# EasyEDA Pro project ProProject_ECE590_2024-03-22.epro

# Schematic Schematic1
Create Date: 2024-03-17; Page Name: P1; Project Name: ECE590; Schematic Name: Schematic1; Update Date: 2024-03-20; Company: 嘉立创EDA; Page Size: A4; Version: V1.0
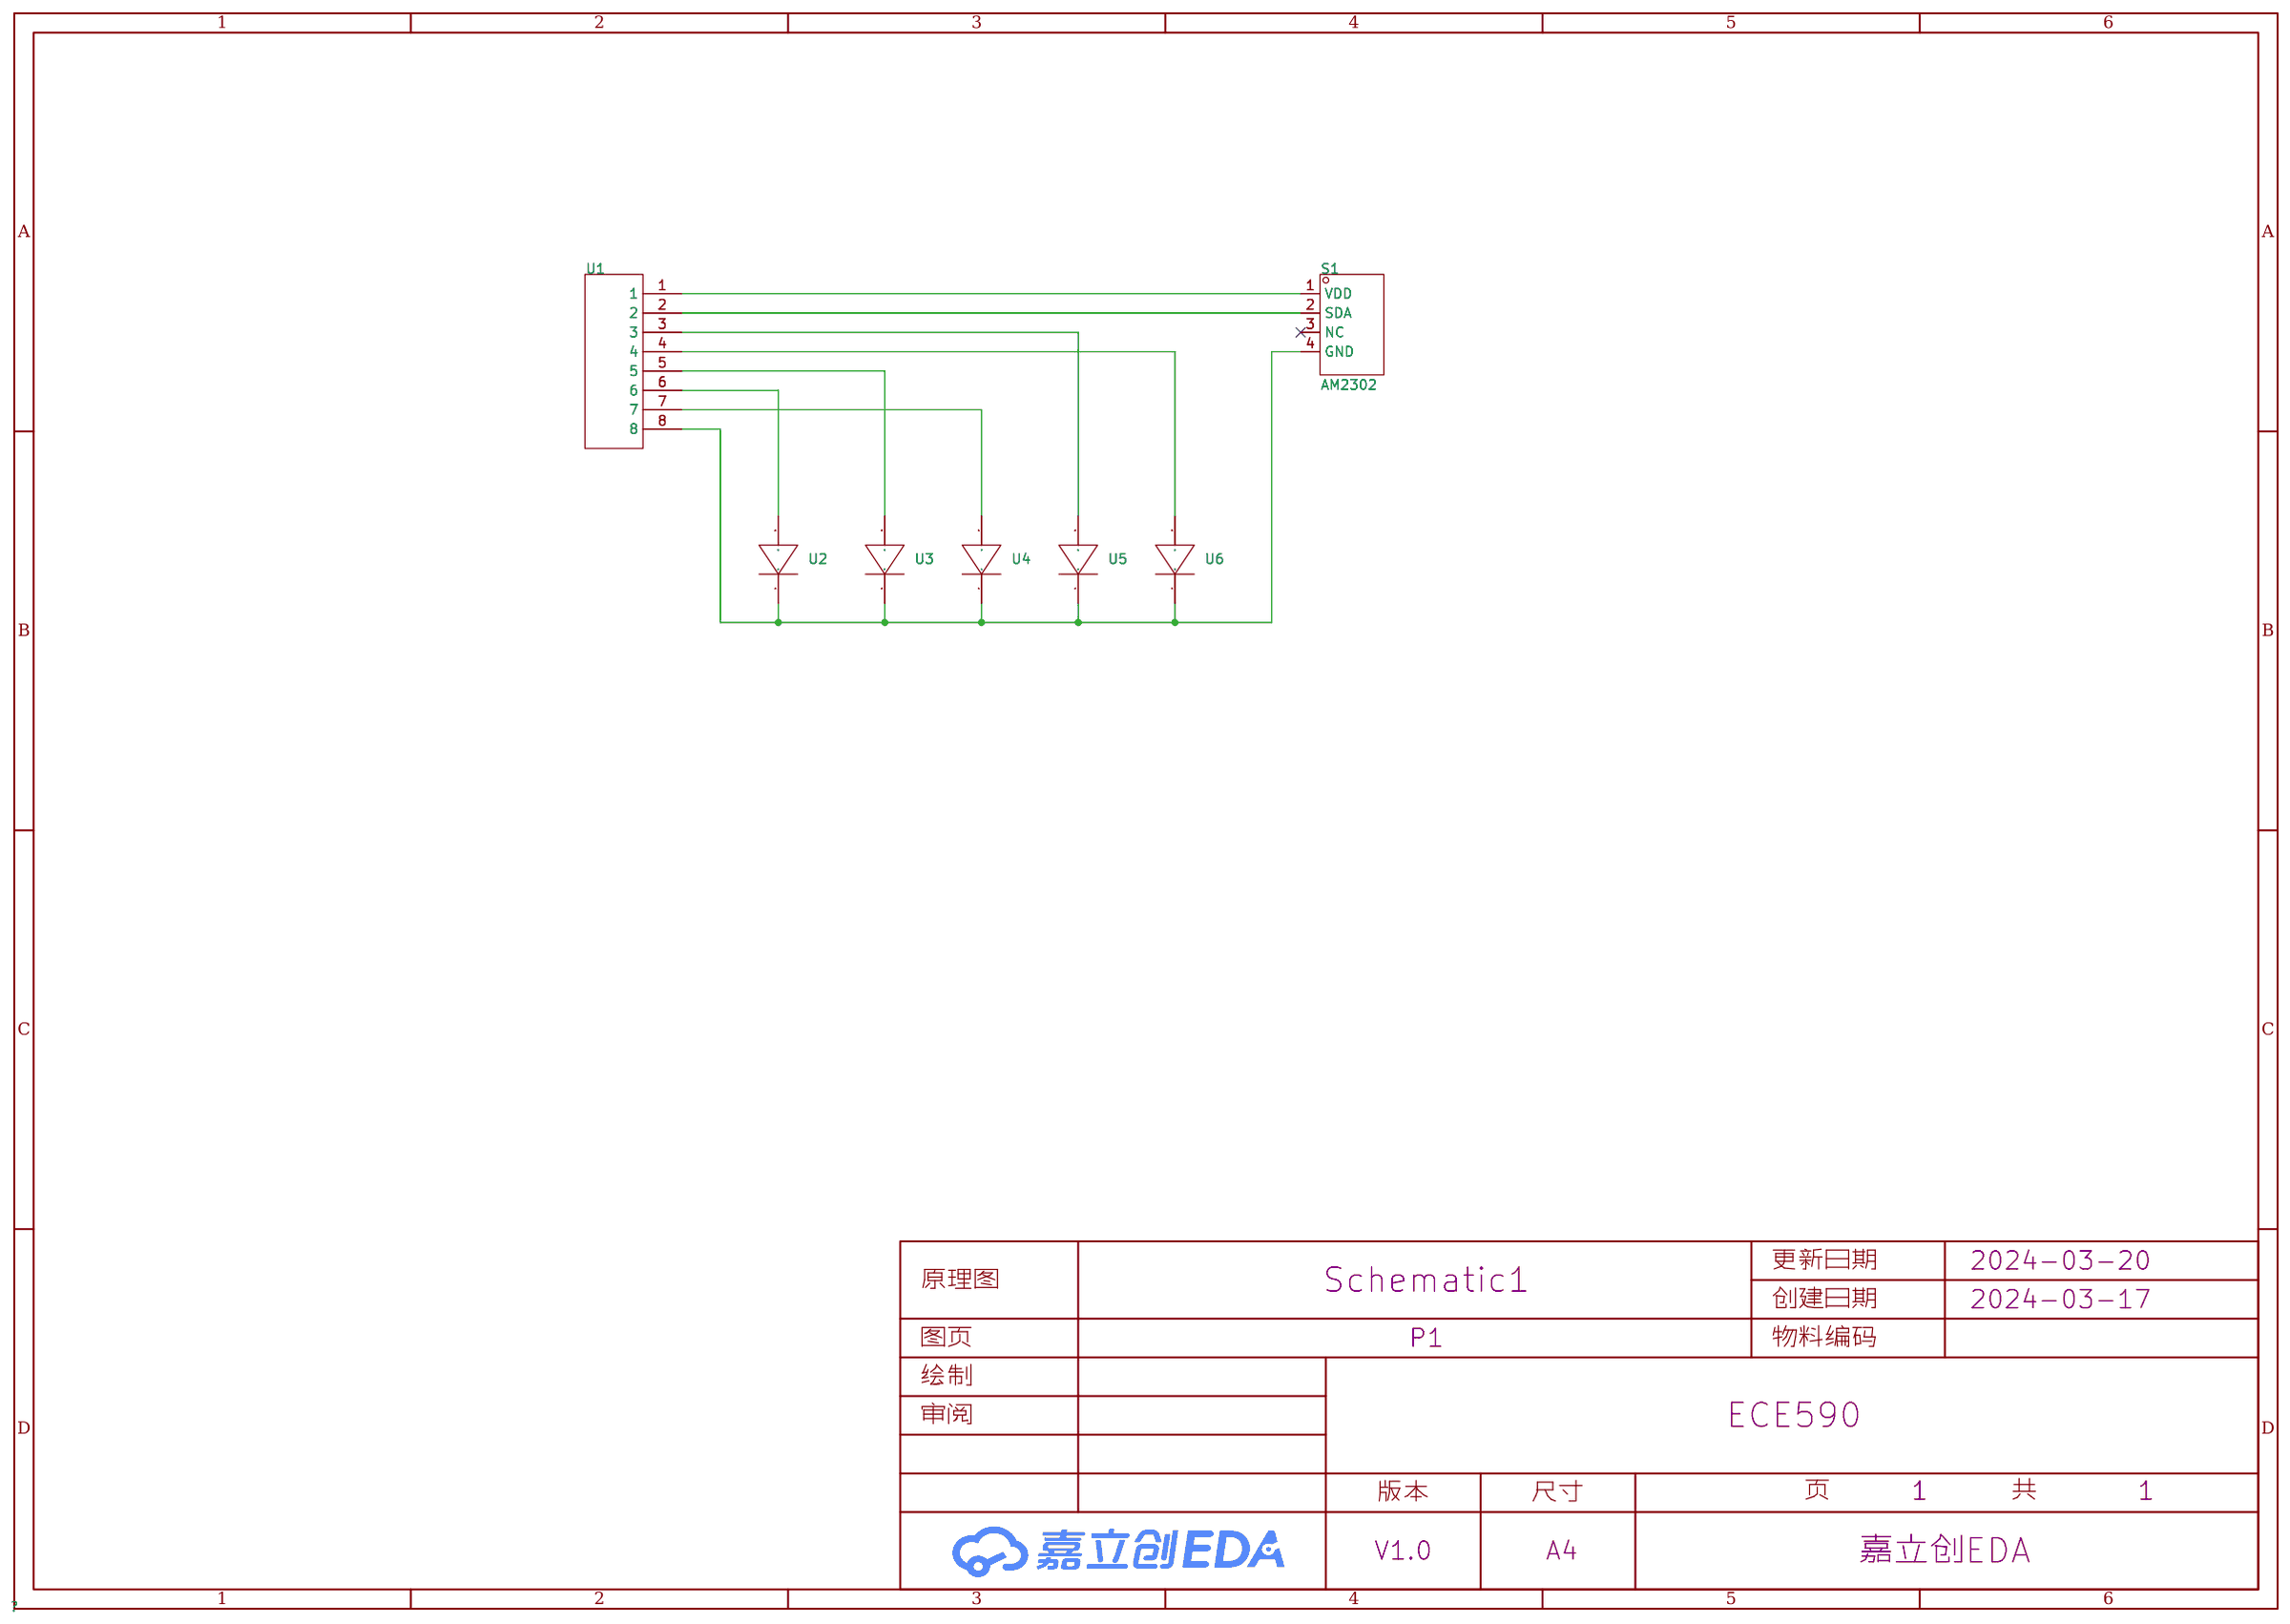
[diagram p0: schematic sheet]

## Parts
S1  AM2302  [SENSOR-TH_AM2302]
U1  -  [PIN-8]
U2  -  [LED_4x9]
U3  -  [LED_4x9]
U4  -  [LED_4x9]
U5  -  [LED_4x9]
U6  -  [LED_4x9]

## Library data of the parts
S1 = AM2302: 数字温湿度传感器25.3x15.4mmx7.8mm; LCSC Part Name: AM2302温湿度传感器; Supplier Part: C83988; Manufacturer: 广州奥松; Supplier Footprint: SIP-4; JLCPCB Part Class: 扩展库; Datasheet: https://atta.szlcsc.com/upload/public/pdf/source/20161123/1479873083101.pdf; Supplier: LCSC
U1 = PIN-8
U2-U6 = Adafruit_LED_4x9

## Nets
$1N1514: S1.1(VDD) U1.1
$1N1517: S1.2(SDA) U1.2
$1N1520: U1.3 U5.2
$1N1527: U1.4 U6.2
$1N1535: U1.5 U3.2
$1N1558: U1.6 U2.2
$1N1565: U1.7 U4.2
$1N1569: S1.4(GND) U1.8 U2.1 U3.1 U4.1 U5.1 U6.1

Not connected (* = marked no-connect by the designer): S1 3(NC)*

# Schematic Schematic2
Create Date: 2024-03-22; Page Name: P1; Project Name: ECE590; Schematic Name: Schematic2; Update Date: 2024-03-21; Company: 嘉立创EDA; Page Size: A4; Version: V1.0
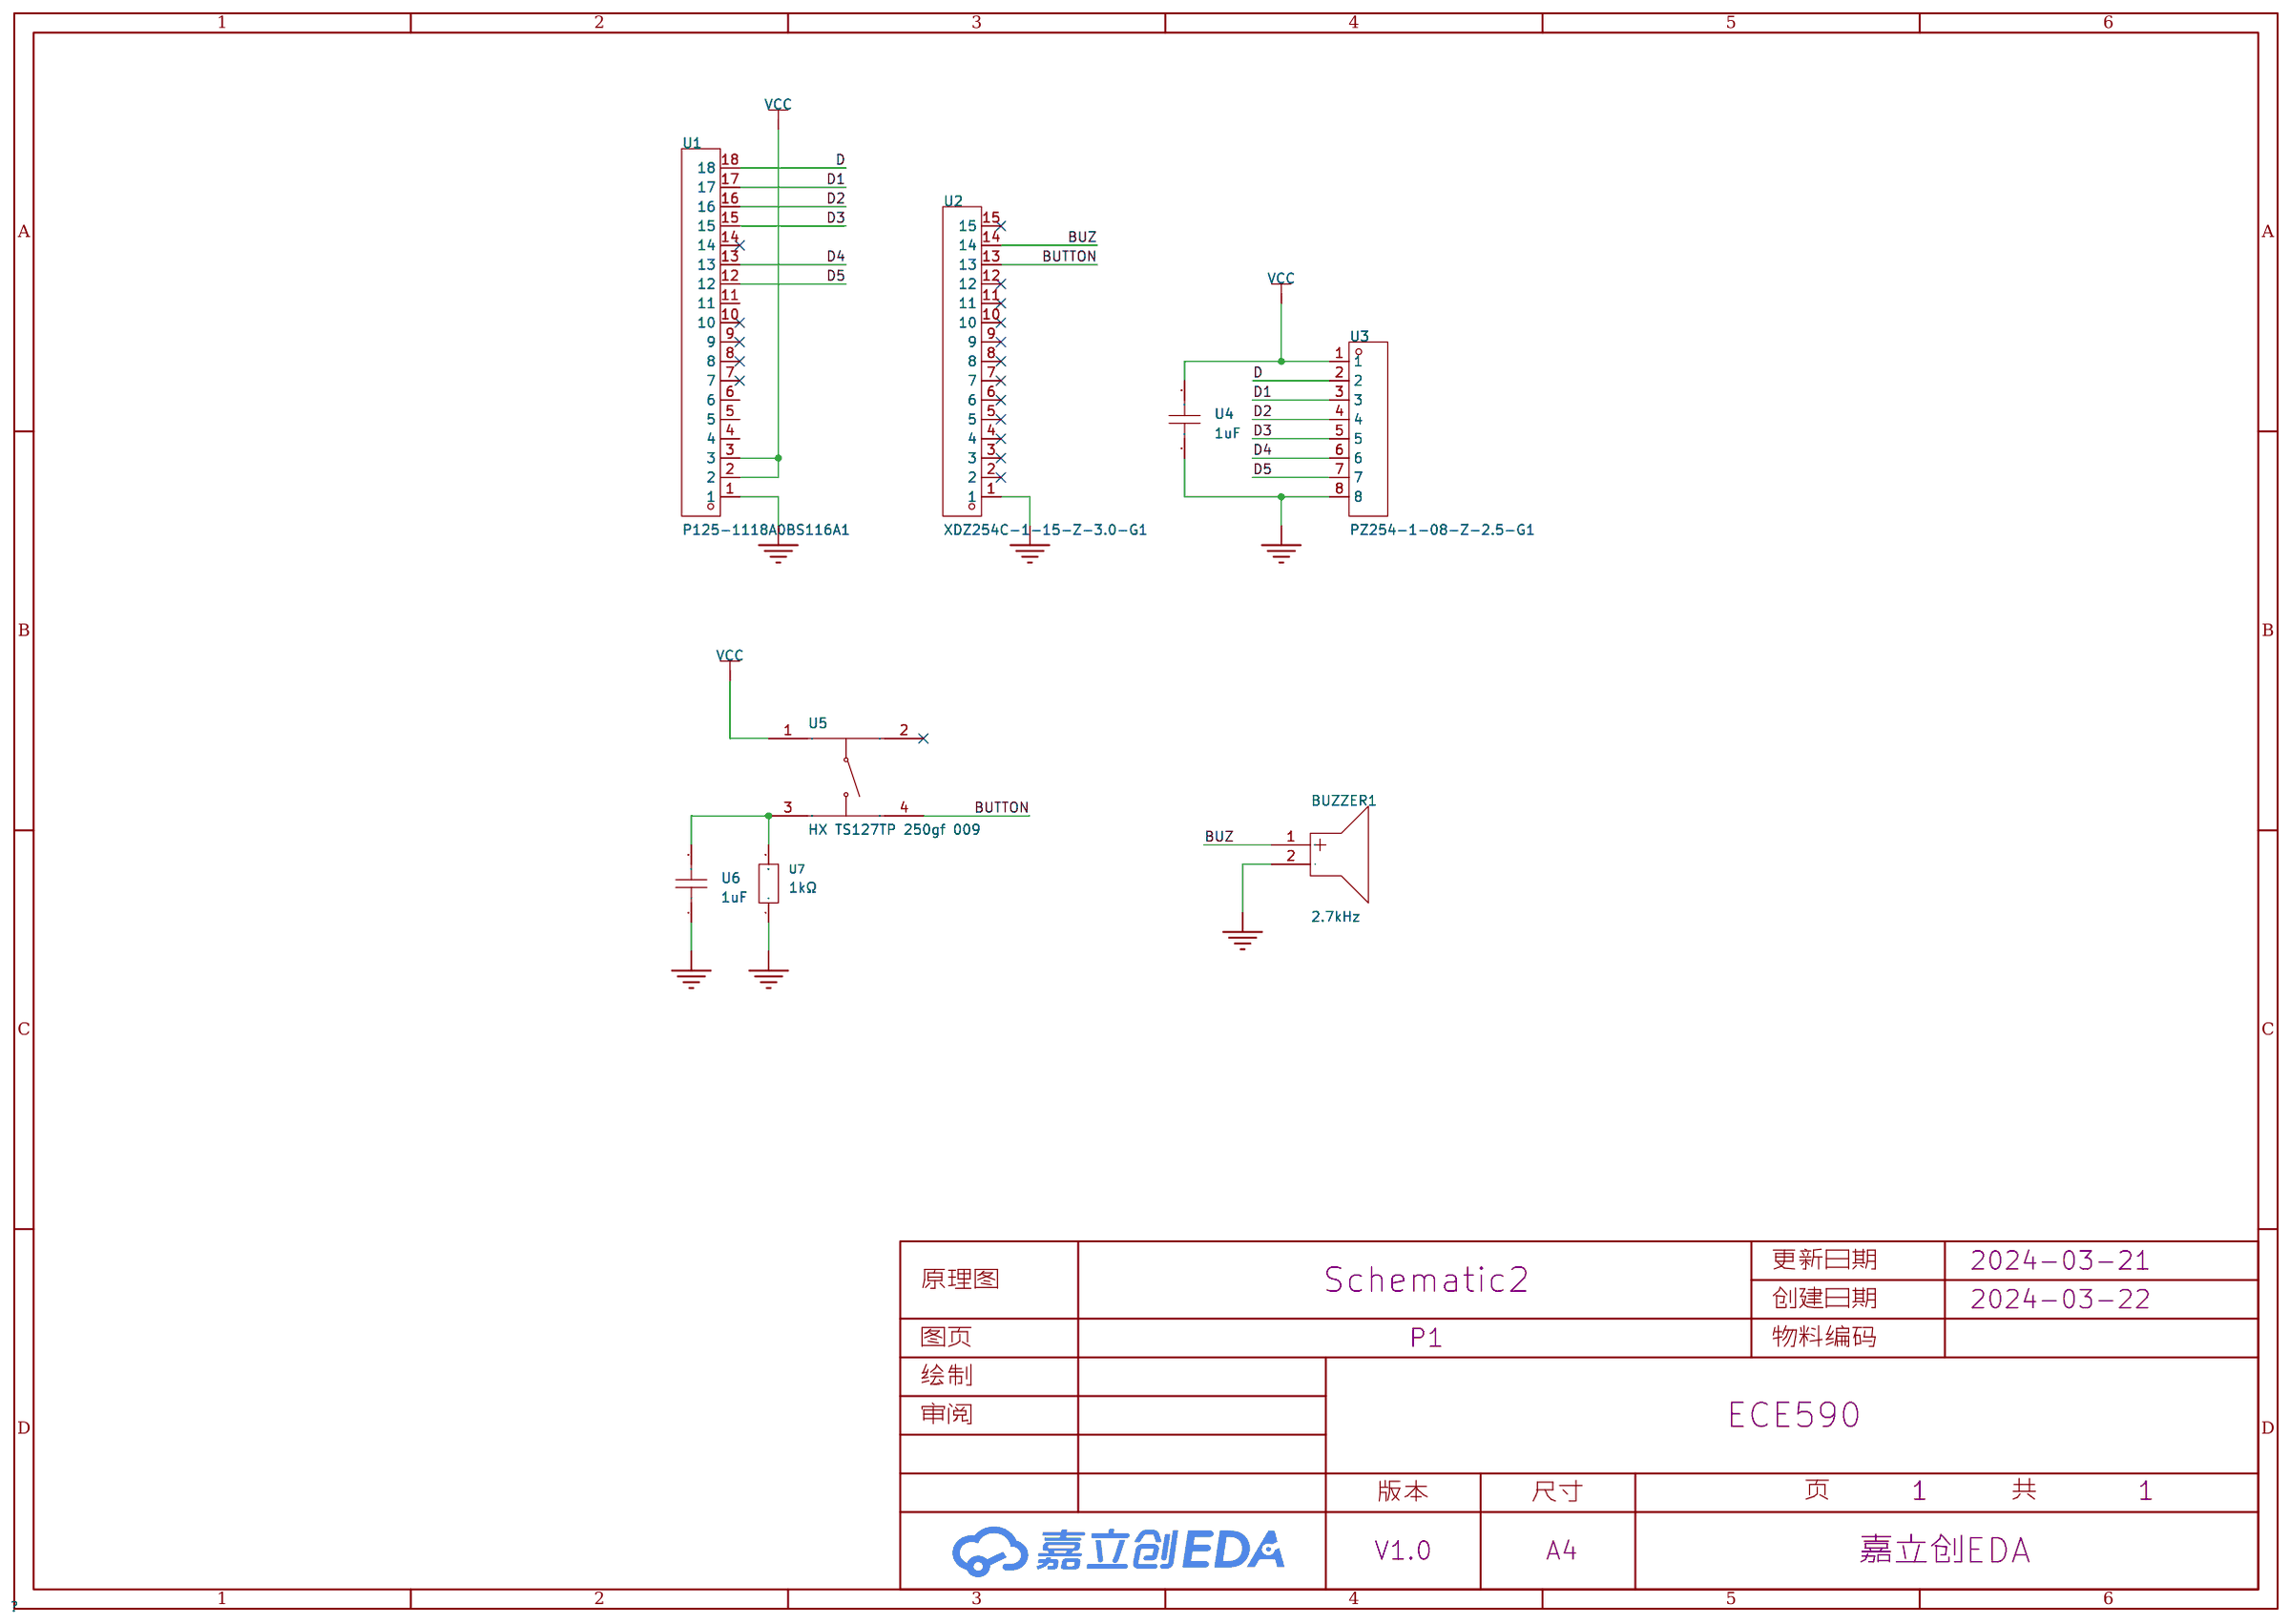
[diagram p1: schematic sheet]

## Parts
BUZZER1  2.7kHz  [BUZ-TH_BD9.0-P5.00-D0.6-FD]
U1  P125-1118A0BS116A1  [HDR-TH_18P-P2.54-V-M]
U2  XDZ254C-1-15-Z-3.0-G1  [HDR-TH_15P-P2.54-V-M]
U3  PZ254-1-08-Z-2.5-G1  [HDR-TH_8P-P2.54-V-M]
U4  1uF  [C0603]
U5  HX TS127TP 250gf 009  [SW-SMD_4P-L12.0-W12.0-P5.00-LS15.4]
U6  1uF  [C0603]
U7  1kΩ  [R0603]

## Library data of the parts
BUZZER1 = YS-MBZ9055DYB03: 驱动方式:有源(内含驱动线路);构造类型:电磁式;频率:2.7kHz;声压(SPL):85dB@3V,10cm;; LCSC Part Name: 电磁式有源一体蜂鸣器3V; Supplier Part: C409835; Manufacturer: Fengming(锋鸣电子); Supplier Footprint: 插件,D=9mm; JLCPCB Part Class: Extended Part; Datasheet: https://atta.szlcsc.com/upload/public/pdf/source/20191217/C409835_3DB20B54A6DEE27B151317CCE90A5EA8.pdf; Supplier: LCSC; Oscillator Circuit: 有源(内含驱动线路); Technology Type: 电磁式; Operating Voltage: 2V~5V; Sound Pressure Level (SPL): 85dB@3V,10cm; Diameter (φD): 9mm; Height: 5.7mm
U1 = P125-1118A0BS116A1: 插针结构:1x18P;间距:2.54mm;行距:2.54mm;圆针/方针:方针;安装类型:直插;排数:单排;总PIN位数:18P;配合针长度:6mm;塑高:2.5mm;端接针长度:3mm;触头材质:黄铜;触头镀层:金;工作温度范围:-40℃~+105℃;颜色:黑色;; LCSC Part Name: 1x18P 间距:2.54mm 方针 直插; Supplier Part: C19190490; Manufacturer: Yxcon(宇熙精密); Supplier Footprint: 插件,P=2.54mm; Datasheet: https://atta.szlcsc.com/upload/public/pdf/source/20231110/FAE60614332F106265C9AC7FE18F609D.pdf; Supplier: LCSC; Pin Structure: 1x18P; Pitch: 2.54mm; Row Spacing: 2.54mm; Circluar Pins/Square Pins: 方针; Mounting Type: 直插; Number of Rows: 单排; Number of Pins: 18P; Length of Mating Pin: 6mm; Insulation Height: 2.5mm; Length of End Connection Pin: 3mm; Contact Material: 黄铜; Contact Plating: 金; Operating Temperature Range: -40℃~+105℃; Color: 黑色
U2 = XDZ254C-1-15-Z-3.0-G1: 插针结构:1x15P;间距:2.54mm;行距:2.54mm;圆针/方针:圆针;安装类型:直插;排数:单排;总PIN位数:15P;额定电流:3A;配合针长度:4.1mm;塑高:3mm;端接针长度:4.1mm;触头材质:黄铜;触头镀层:金;工作温度范围:-40℃~+105℃;焊接温度(最大值):260℃;颜色:黑色;; LCSC Part Name: 1x15P 间距:2.54mm 圆针 直插; Supplier Part: C19184347; Manufacturer: XUNDA(讯答); Supplier Footprint: 插件,P=2.54mm; Datasheet: https://atta.szlcsc.com/upload/public/pdf/source/20231031/80EB086313D71B9565099D177A944F6B.pdf; Supplier: LCSC; Pin Structure: 1x15P; Pitch: 2.54mm; Row Spacing: 2.54mm; Circluar Pins/Square Pins: 圆针; Mounting Type: 直插; Number of Rows: 单排; Number of Pins: 15P; Current Rating (Max): 3A; Length of Mating Pin: 4.1mm; Insulation Height: 3mm; Length of End Connection Pin: 4.1mm; Contact Material: 黄铜; Contact Plating: 金; Operating Temperature Range: -40℃~+105℃; Soldering Temperature(Max): 260℃; Color: 黑色
U3 = PZ254-1-08-Z-2.5-G1: 插针结构:1x8P;间距:2.54mm;行距:-;圆针/方针:方针;安装类型:直插;排数:单排;总PIN位数:8P;额定电流:3A;配合针长度:6mm;塑高:2.5mm;端接针长度:3mm;触头材质:黄铜;工作温度范围:-40℃~+105℃;焊接温度(最大值):260℃@10S;颜色:黑色;; LCSC Part Name: 1x8P 间距:2.54mm 方针 直插; Supplier Part: C18197915; Manufacturer: HCTL(华灿天禄); Supplier Footprint: 插件,P=2.54mm; Datasheet: https://atta.szlcsc.com/upload/public/pdf/source/20230921/1753130D8F97492C8335A75164C0C73A.pdf; Supplier: LCSC; Pin Structure: 1x8P; Pitch: 2.54mm; Circluar Pins/Square Pins: 方针; Mounting Type: 直插; Number of Rows: 单排; Number of Pins: 8P; Current Rating (Max): 3A; Length of Mating Pin: 6mm; Insulation Height: 2.5mm; Length of End Connection Pin: 3mm; Contact Material: 黄铜; Operating Temperature Range: -40℃~+105℃; Soldering Temperature(Max): 260℃@10S; Color: 黑色
U4 U6 = VJ0603Y105KXJCW1BC: 容值:1uF;精度:±10%;额定电压:16V;材质(温度系数):X7R;; LCSC Part Name: 1uF ±10% 16V; Supplier Part: C2169543; Manufacturer: VISHAY(威世); Supplier Footprint: 0603; JLCPCB Part Class: Extended Part; Datasheet: https://atta.szlcsc.com/upload/public/pdf/source/20210505/5B6BCDCCC79EB6FDB5714324D06E9DF3.pdf; Supplier: LCSC; Tolerance: ±10%; Voltage Rated: 16V; Temperature Coefficient: X7R
U5 = HX TS127TP 250gf 009: 电路结构:单刀单掷;作用力:250gf;安装方式:立贴;开关长度:12mm;开关宽度:12mm;开关高度:7mm;带支架:不带;触点电流:50mA;额定电压(DC):12V;机械寿命:10万次;; LCSC Part Name: 12x12x7mm 立贴 轻触开关; Supplier Part: C18357561; Manufacturer: hanxia(韩下); Supplier Footprint: 插件,12x12mm; Datasheet: https://atta.szlcsc.com/upload/public/pdf/source/20231016/F35C274B9EBF301EAC4404BB7B8D56BC.pdf; Supplier: LCSC; Circuit: 单刀单掷; Operating Force: 250gf; Mounting Style: 立贴; Switch Length: 12mm; Switch Width: 12mm; Switch Height: 7mm; Strike Gundam: 不带; Contact Current: 50mA; Voltage Rating (DC): 12V; Mechanical Life: 10万次
U7 = AC0603JR-131KL: 电阻类型:厚膜电阻;阻值:1kΩ;精度:±5%;功率:100mW;最大工作电压:75V;温度系数:±100ppm/℃;; LCSC Part Name: 厚膜电阻 1kΩ ±5% 100mW; Supplier Part: C2971752; Manufacturer: YAGEO(国巨); Supplier Footprint: 0603; JLCPCB Part Class: Extended Part; Datasheet: https://atta.szlcsc.com/upload/public/pdf/source/20180927/C229861_4ABDC471507C1ED6AFB4BA66AFC8620A.pdf; Supplier: LCSC; Type: 厚膜电阻; Tolerance: ±5%; Power(Watts): 100mW; Overload Voltage (Max): 75V; Temperature Coefficient: ±100ppm/℃; Operating Temperature Range: -55℃~+155℃

## Nets
GND: BUZZER1.2(-) U1.1 U2.1 U3.8 U4.1 U6.1 U7.1
VCC: U1.2 U1.3 U3.1 U4.2 U5.1(A)
BUTTON: U2.13 U5.4(D)
BUZ: BUZZER1.1(+) U2.14
D: U1.18 U3.2
D1: U1.17 U3.3
D2: U1.16 U3.4
D3: U1.15 U3.5
D4: U1.13 U3.6
D5: U1.12 U3.7
$1N836: U5.3(C) U6.2 U7.2

Not connected (* = marked no-connect by the designer): U1 4 5 6 7* 8* 9* 10* 11 14*; U2 2* 3* 4* 5* 6* 7* 8* 9* 10* 11* 12* 15*; U5 2(B)*

# Board PCB1
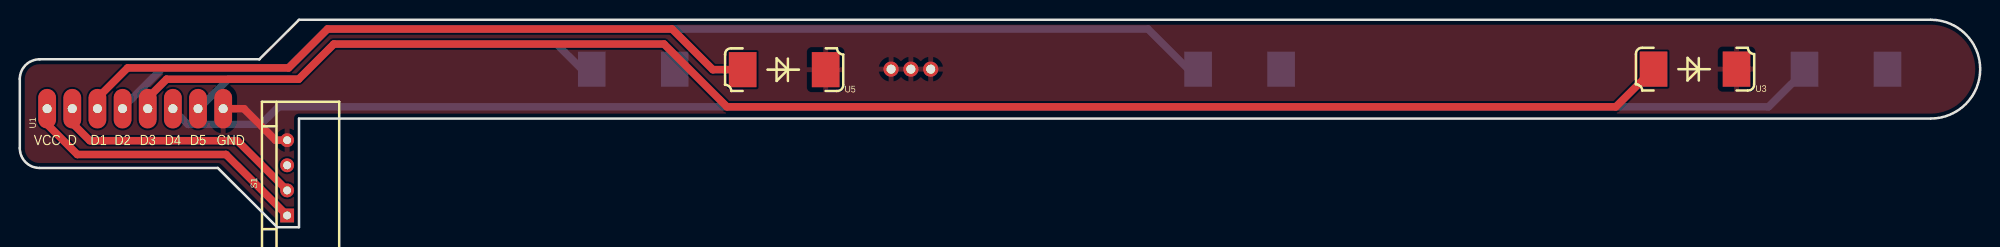
[diagram p2: board, top side]
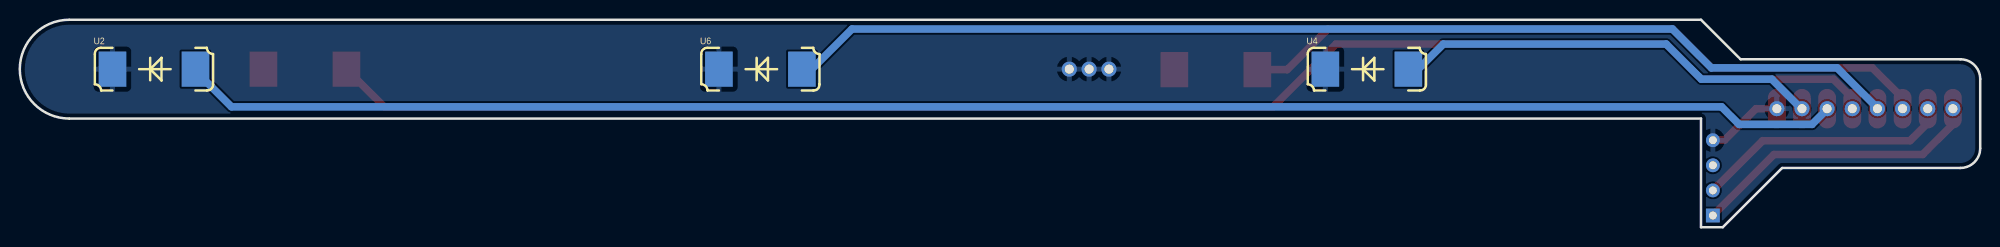
[diagram p3: board, bottom side, seen from below]

Outline 198 x 21 mm; copper layers: Top Layer, Bottom Layer. Coordinates in mm from the lower left corner of the outline.
Outline path: 0,15 0,8 arc(0.59,6.59) 2,6 20,6 26,0 28.2,0 28.2,11 193,11 arc(198,16) 193,21 28.2,21 24.2,17 2.01,17 arc(0.59,16.42) 0,15
Stack: Top Layer 0.035mm - / Dielectric1 0.91mm FR4 er 4.5 / Bottom Layer 0.035mm -

## Design rules (mm)
template: 自定义配置
spacing copperThickness1oz (default): track to track 0.102, other pairs 0.152 to 0.3
spacing copperThickness2oz: track to track 0.203, other pairs 0.152 to 0.3
track width copperThickness1oz (default): min 0.127, default 0.254, max 2.54
track width copperThickness2oz: min 0.203, default 0.254, max 2.54
differential pair differentialPair (default): width min 0.127, default 0.254, max 2.54; gap min 0.152, default 0.152
via viaSize (default): diameter min 0.5, default 0.61, max 10; hole min 0.3, default 0.305, max 6.299

## Placement (name value [footprint] x y rotation side)
NOREF  -  [Pad_e60]  15.46 12 0 top
NOREF#2  -  [Pad_e348]  92 16 0 top
NOREF#3  -  [Pad_e56]  5.3 12 0 top
NOREF#4  -  [Pad_e59]  12.92 12 0 top
NOREF#5  -  [Pad_e347]  90 16 0 top
NOREF#6  -  [Pad_e61]  18 12 0 top
NOREF#7  -  [Pad_e58]  10.38 12 0 top
NOREF#8  -  [Pad_e346]  88 16 0 top
NOREF#9  -  [Pad_e55]  2.76 12 0 top
NOREF#10  -  [Pad_e57]  7.84 12 0 top
NOREF#11  -  [Pad_e62]  20.54 12 0 top
S1  AM2302  [SENSOR-TH_AM2302]  27 5 90 top
U1  -  [PIN-8]  2.76 12 90 top
U2  -  [LED_4x9]  184.45 16 180 bottom
U3  -  [LED_4x9]  169.2 16 180 top
U4  -  [LED_4x9]  61.95 16 180 bottom
U5  -  [LED_4x9]  77.2 15.95 180 top
U6  -  [LED_4x9]  123.2 16 180 bottom

## Footprints (pads in the part's own frame, mm; a bottom-side part is the same pattern mirrored in y, then rotated)
LED_4x9
  rect 2.794x3.556 smd: 1(-4.191,0) 2(4.191,0)
Pad_e55
  round 1.524 hole 0.914: 9(0,0)
Pad_e56
  round 1.524 hole 0.914: 10(0,0)
Pad_e57
  round 1.524 hole 0.914: 11(0,0)
Pad_e58
  round 1.524 hole 0.914: 12(0,0)
Pad_e59
  round 1.524 hole 0.914: 13(0,0)
Pad_e60
  round 1.524 hole 0.914: 14(0,0)
Pad_e61
  round 1.524 hole 0.914: 15(0,0)
Pad_e62
  round 1.524 hole 0.914: 16(0,0)
Pad_e346
  round 1.524 hole 0.914: 17(0,0)
Pad_e347
  round 1.524 hole 0.914: 18(0,0)
Pad_e348
  round 1.524 hole 0.914: 19(0,0)
PIN-8
  oval 4x1.8 smd: 1(0,0) 2(0,-2.54) 3(0,-5.08) 4(0,-7.62) 5(0,-10.16) 6(0,-12.7) 7(0,-15.24) 8(0,-17.78)
SENSOR-TH_AM2302
  rect 1.4x1.4 hole 0.8: 1(-3.81,0)
  round 1.4 hole 0.8: 2(-1.27,0) 3(1.27,0) 4(3.81,0)

## Nets
$1N1514: NOREF#9.9 S1.1 U1.1
$1N1517: NOREF#3.10 S1.2 U1.2
$1N1520: NOREF#10.11 U1.3 U5.2
$1N1527: NOREF#7.12 U1.4 U6.2
$1N1535: NOREF#4.13 U1.5 U3.2
$1N1558: NOREF.14 U1.6 U2.2
$1N1565: NOREF#6.15 U1.7 U4.2
$1N1569: NOREF#2.19 NOREF#5.18 NOREF#8.17 NOREF#11.16 S1.4 U1.8 U2.1 U3.1 U4.1 U5.1 U6.1

Pads without a net: S1 3

## Routing (per net, layer and track width the routed paths; a pad name or vN(x,y) marks a point on that pad's centre or on a via; arc(x,y) is an arc through that point)
$1N1514: length 29.6
  Top Layer w0.762: U1.1 2.76,10.41 5.81,7.36 20.83,7.36 S1.1
$1N1517: length 26
  Top Layer w0.762: NOREF#3.10 5.3,10.54 7.08,8.76 21.97,8.76 S1.2
$1N1520: length 69.8
  Top Layer w0.762: 7.84,13.08 10.89,16.13 27.14,16.13 31.08,20.06 65.88,20.06 69.99,15.95 U5.2
$1N1527: length 112.7
  Bottom Layer w0.762: 118.01,16 113.94,20.06 31.08,20.06 27.14,16.13 14.44,16.13 10.38,12.06 U1.4
$1N1535: length 158.6
  Top Layer w0.762: 12.92,13.08 14.83,14.98 28.16,14.98 31.72,18.54 65.07,18.54 71.42,12.19 161.2,12.19 U3.2
$1N1558: length 167.9
  Bottom Layer w0.762: NOREF.14 15.46,11.94 16.98,10.41 24.35,10.41 26.13,12.19 176.62,12.19 180.26,15.83 U2.2
$1N1565: length 42.5
  Bottom Layer w0.762: 56.76,16 54.22,18.54 31.72,18.54 28.16,14.98 21.05,14.98 18.06,12 U1.7
$1N1569: length 7.8
  Top Layer w0.762: U1.8 22.64,12 25.83,8.81 S1.4

## Copper pours and planes (outline as drawn; the poured copper is in the pictures)
$1N1569 on Top Layer: -0.54,21.46 199.1,21.46 199.1,-1.02 -0.54,-1.02
$1N1569 on Bottom Layer: -0.54,21.46 199.1,21.46 199.1,-1.02 -0.54,-1.02

## Text on the board
Top Silkscreen Layer: VCC | D | D1 | D2 | D3 | D4 | D5 | GND

# Board PCB4
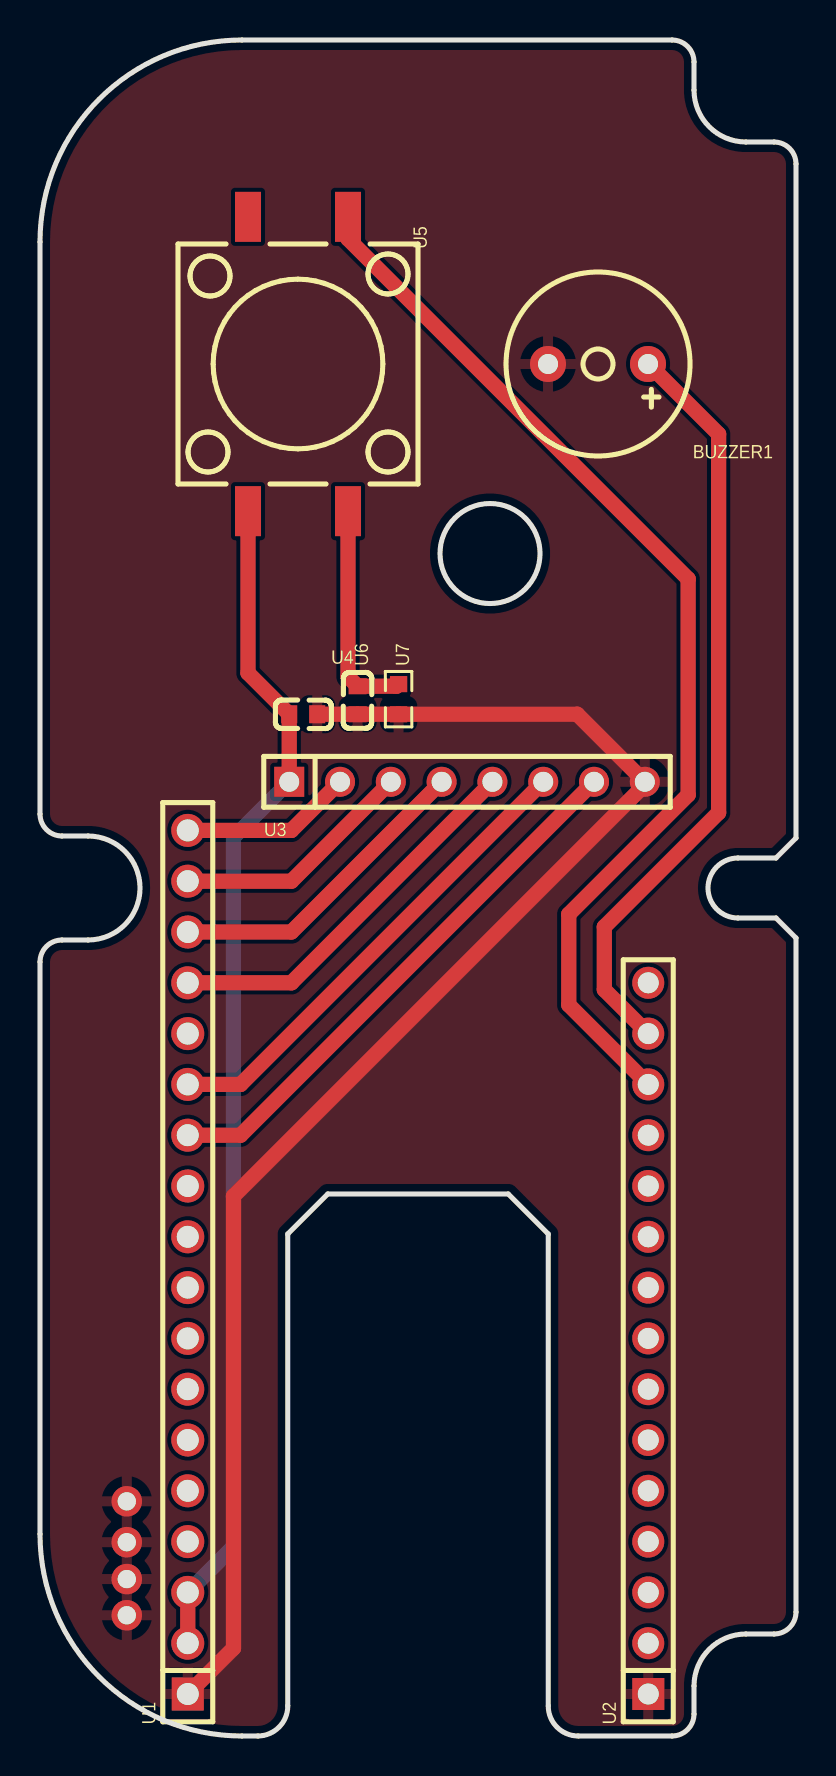
[diagram p4: board, top side]
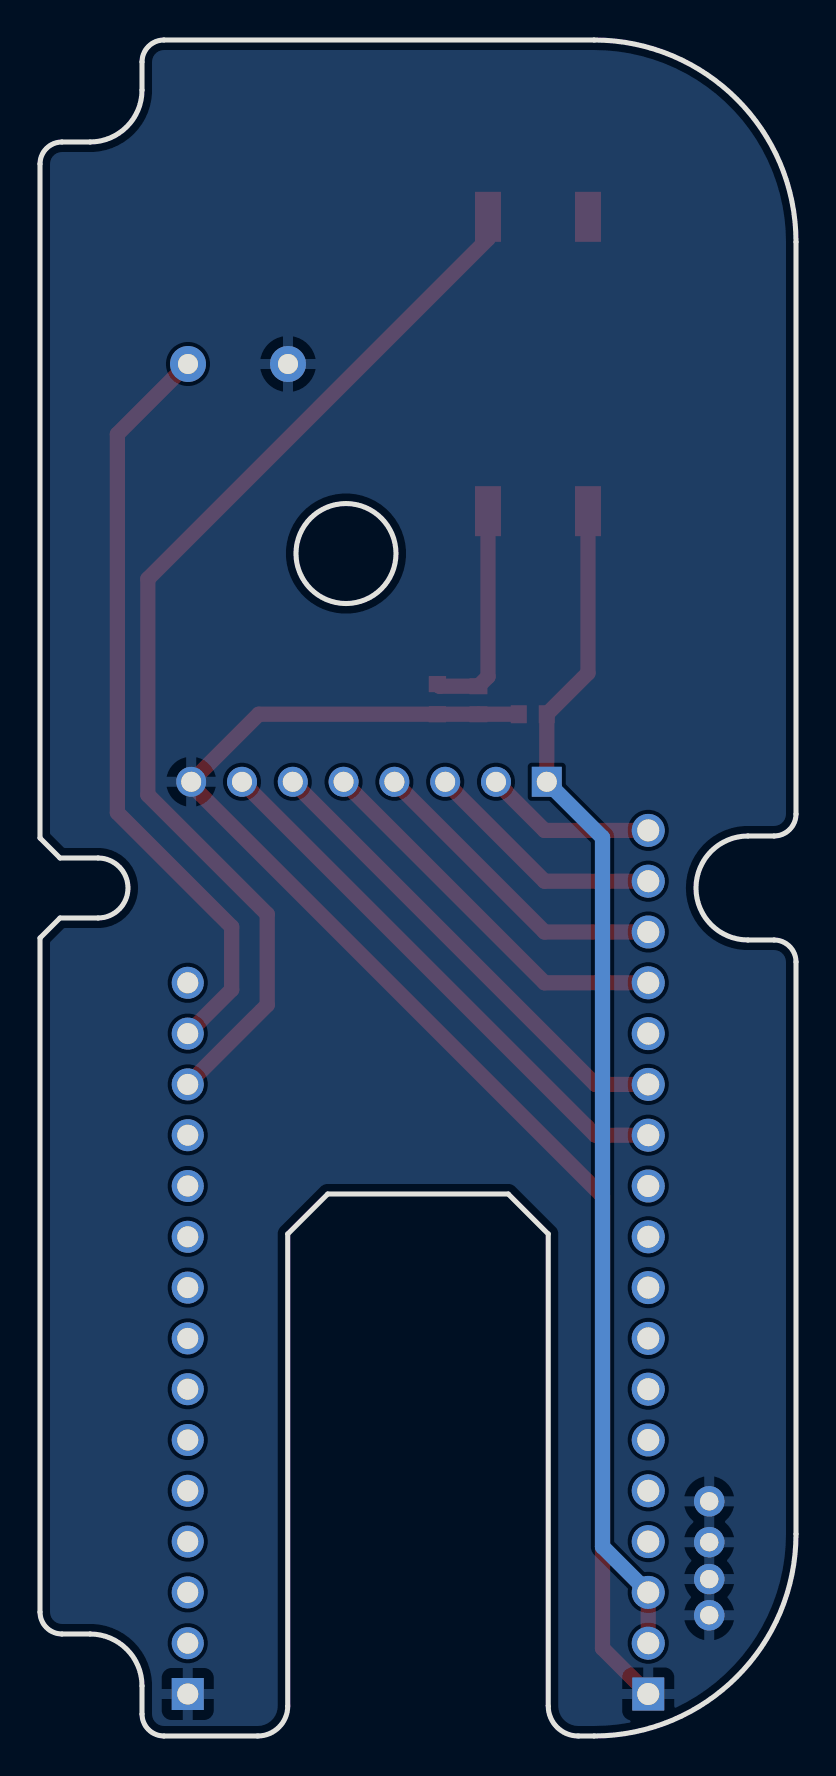
[diagram p5: board, bottom side, seen from below]

Outline 37.8 x 84.8 mm; copper layers: Top Layer, Bottom Layer. Coordinates in mm from the lower left corner of the outline.
Outline path: circle c22.5,59.12 r2.5 ; 0,74.7 arc(2.96,81.84) 10.1,84.8 31.6,84.8 arc(32.38,84.48) 32.7,83.7 32.7,82.3 arc(33.46,80.46) 35.3,79.7 36.7,79.7 arc(37.48,79.38) 37.8,78.6 37.8,44.9 36.8,43.9 34.9,43.9 arc(33.4,42.4) 34.9,40.9 36.8,40.9 37.8,39.9 37.8,6.2 arc(37.48,5.42) 36.7,5.1 35.3,5.1 arc(33.46,4.34) 32.7,2.5 32.7,1.1 arc(32.38,0.32) 31.6,0 26.91,0 arc(25.85,0.44) 25.41,1.5 25.41,25.1 23.41,27.1 14.39,27.1 12.39,25.1 12.39,1.5 arc(11.95,0.44) 10.89,0 10.1,0 arc(2.96,2.96) 0,10.1 0,38.7 arc(0.32,39.48) 1.1,39.8 2.4,39.8 arc(5,42.4) 2.4,45 1.1,45 arc(0.32,45.32) 0,46.1 0,74.7
Stack: Top Layer 0.035mm - / Dielectric1 0.91mm FR4 er 4.5 / Bottom Layer 0.035mm -

## Design rules (mm)
template: JLCPCB Capability(Two Layers Board)
spacing copperThickness1oz (default): track to track 0.102, other pairs 0.152 to 0.3
spacing copperThickness2oz: track to track 0.203, other pairs 0.152 to 0.3
track width copperThickness1oz (default): min 0.127, default 0.254, max 2.54
track width copperThickness2oz: min 0.203, default 0.254, max 2.54
differential pair differentialPair (default): width min 0.127, default 0.254, max 2.54; gap min 0.152, default 0.152
via viaSize (default): diameter min 0.5, default 0.61, max 10; hole min 0.3, default 0.305, max 6.3

## Placement (name value [footprint] x y rotation side)
BUZZER1  2.7kHz  [BUZ-TH_BD9.0-P5.00-D0.6-FD]  27.9 68.6 180 top
NOREF  -  [Pad_e497]  4.34 7.85 0 top
NOREF#2  -  [Pad_e496]  4.34 6.04 0 top
NOREF#3  -  [Pad_e498]  4.34 9.69 0 top
NOREF#4  -  [Pad_e499]  4.34 11.73 0 top
U1  P125-1118A0BS116A1  [HDR-TH_18P-P2.54-V-M]  7.39 23.69 90 top
U2  XDZ254C-1-15-Z-3.0-G1  [HDR-TH_15P-P2.54-V-M]  30.41 19.88 90 top
U3  PZ254-1-08-Z-2.5-G1  [HDR-TH_8P-P2.54-V-M]  21.35 47.71 0 top
U4  1uF  [C0603]  13.16 51.09 180 top
U5  HX TS127TP 250gf 009  [SW-SMD_4P-L12.0-W12.0-P5.00-LS15.4]  12.9 68.6 270 top
U6  1uF  [C0603]  15.88 51.79 90 top
U7  1kΩ  [R0603]  17.93 51.84 90 top

## Footprints (pads in the part's own frame, mm; a bottom-side part is the same pattern mirrored in y, then rotated)
BUZ-TH_BD9.0-P5.00-D0.6-FD
  round 1.8 hole 1: 1(-2.5,0) 2(2.5,0)
C0603
  rect 0.8x0.9 smd: 1(-0.7,0) 2(0.7,0)
HDR-TH_8P-P2.54-V-M
  rect 1.5x1.5 hole 1: 1(-8.89,0)
  round 1.5 hole 1: 2(-6.35,0) 3(-3.81,0) 4(-1.27,0) 5(1.27,0) 6(3.81,0) 7(6.35,0) 8(8.89,0)
HDR-TH_15P-P2.54-V-M
  rect 1.6x1.6 hole 1.05: 1(-17.78,0)
  round 1.6 hole 1.05: 2(-15.24,0) 3(-12.7,0) 4(-10.16,0) 5(-7.62,0) 6(-5.08,0) 7(-2.54,0) 8(0,0) 9(2.54,0) 10(5.08,0) 11(7.62,0) 12(10.16,0) 13(12.7,0) 14(15.24,0) 15(17.78,0)
HDR-TH_18P-P2.54-V-M
  rect 1.65x1.6 hole 1.1: 1(-21.59,0)
  round 1.65 hole 1.1: 2(-19.05,0) 3(-16.51,0) 4(-13.97,0) 5(-11.43,0) 6(-8.89,0) 7(-6.35,0) 8(-3.81,0) 9(-1.27,0) 10(1.27,0) 11(3.81,0) 12(6.35,0) 13(8.89,0) 14(11.43,0) 15(13.97,0) 16(16.51,0) 17(19.05,0) 18(21.59,0)
Pad_e496
  round 1.524 hole 0.914: 19(0,0)
Pad_e497
  round 1.524 hole 0.914: 20(0,0)
Pad_e498
  round 1.524 hole 0.914: 21(0,0)
Pad_e499
  round 1.524 hole 0.914: 22(0,0)
R0603
  rect 0.806x0.864 smd: 1(-0.753,0) 2(0.753,0)
SW-SMD_4P-L12.0-W12.0-P5.00-LS15.4
  rect 2.5x1.3 smd: 1(7.358,-2.5) 2(-7.358,-2.5) 3(7.358,2.5) 4(-7.358,2.5)

## Nets
As in the schematic, except:
GND: BUZZER1.2 NOREF.20 NOREF#2.19 NOREF#3.21 NOREF#4.22 U1.1 U2.1 U3.8 U4.1 U6.1 U7.1

Pads without a net: U1 4 5 6 7 8 9 10 11 14; U2 2 3 4 5 6 7 8 9 10 11 12 15; U5 2

## Routing (per net, layer and track width the routed paths; a pad name or vN(x,y) marks a point on that pad's centre or on a via; arc(x,y) is an arc through that point)
GND: length 72.9
  Top Layer w0.762: U4.1 U6.1 U7.1 26.86,51.09 U3.8 30.24,47.56 9.67,26.99 9.67,4.39 U1.1
VCC: length 59.6
  Top Layer w0.762: U1.2 U1.3 ; U5.1 10.4,53.15 U4.2 U3.1
  Bottom Layer w0.762: U3.1 9.67,44.92 9.67,9.47 U1.3
BUTTON: length 54.5
  Top Layer w0.762: U2.13 26.44,36.55 26.44,41.09 32.41,47.06 32.41,57.85 15.4,74.86 U5.4
BUZ: length 38.2
  Top Layer w0.762: BUZZER1.1 30.42,68.6 33.93,65.09 33.93,46.17 28.22,40.45 28.22,37.32 U2.14
D: length 8.6
  Top Layer w0.762: U1.18 12.57,45.28 U3.2
D1: length 12.2
  Top Layer w0.762: U1.17 12.57,42.74 U3.3
D2: length 15.8
  Top Layer w0.762: U1.16 12.57,40.2 U3.4
D3: length 19.4
  Top Layer w0.762: U3.5 12.57,37.66 U1.15
D4: length 24
  Top Layer w0.762: U3.6 10.03,32.58 U1.13
D5: length 27.6
  Top Layer w0.762: U1.12 10.03,30.04 U3.7
$1N836: length 11
  Top Layer w0.762: U7.2 17.82,52.49 U6.2 15.4,52.97 U5.3

## Copper pours and planes (outline as drawn; the poured copper is in the pictures)
GND on Top Layer: -0.1,84.9 37.9,84.9 37.9,-0.1 -0.1,-0.1
GND on Bottom Layer: -0.1,84.9 37.9,84.9 37.9,-0.1 -0.1,-0.1
